# Altium schematic sheet Sheet2.SchDoc
size A4; SheetNumber: 2; SheetTotal: 6
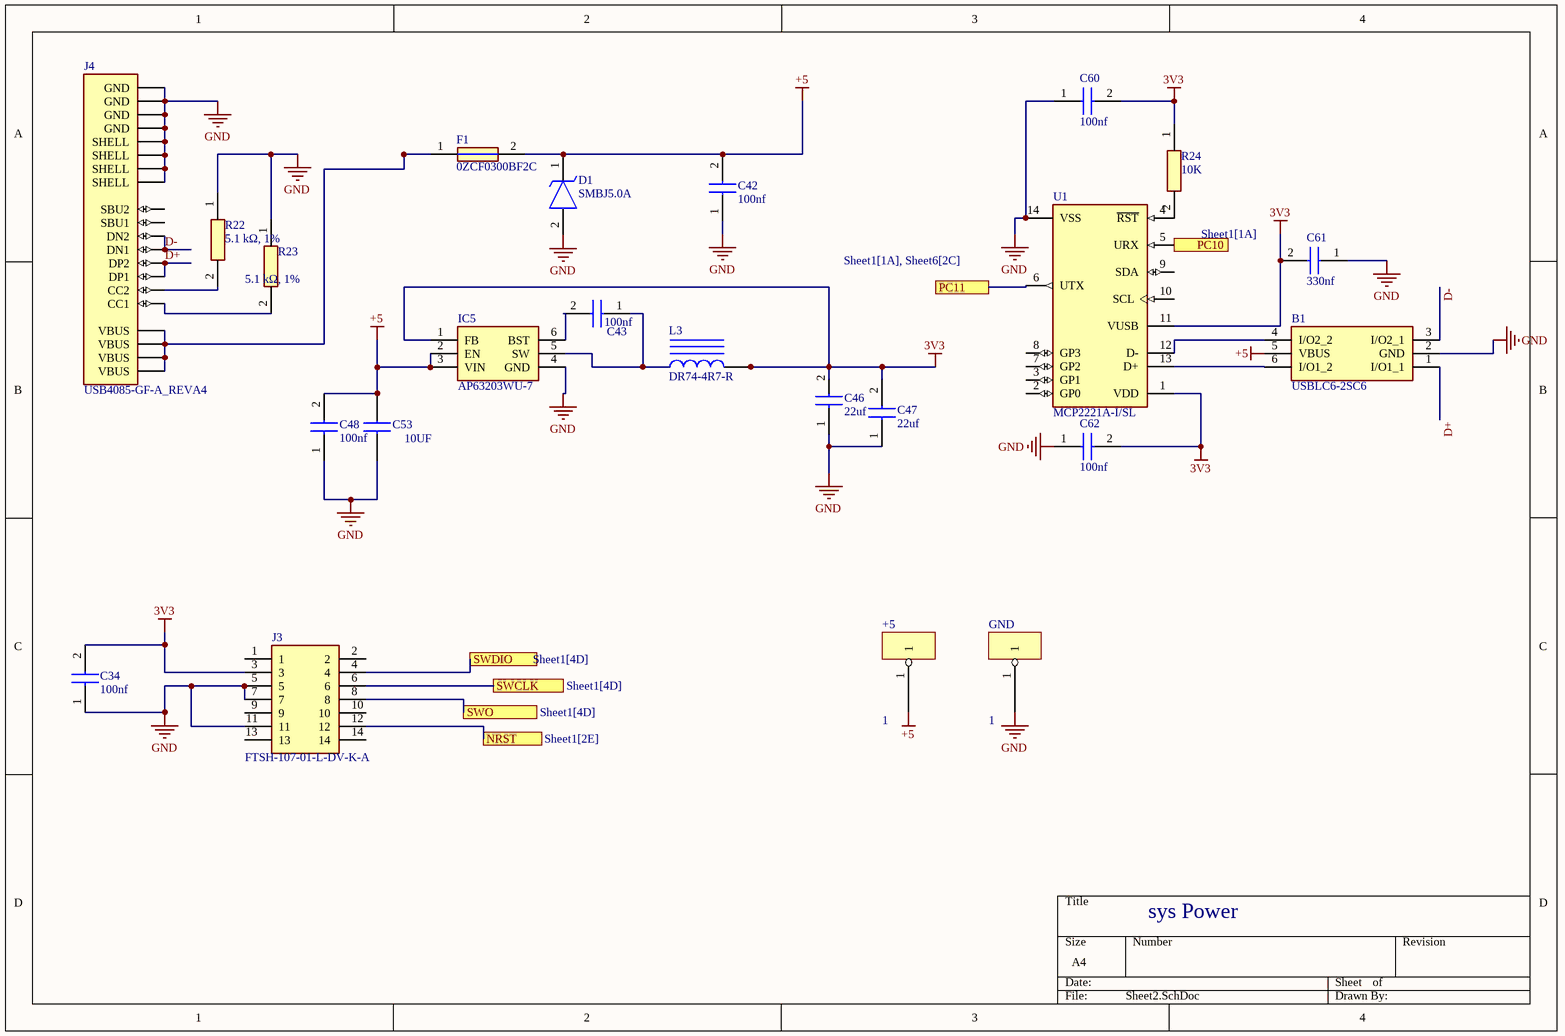
[diagram p0: Sheet2.SchDoc]

## Parts
+5  1  [ANT]
B1  USBLC6-2SC6  [SOT95P280X145-6N]
C34  100nf  [CAPC1608X95N]
C42  100nf  [CAPC1608X95N]
C43  100nf  [CAPC1608X95N]
C46  22uf  [CAPC1608X95N]
C47  22uf  [CAPC1608X95N]
C48  100nf  [CAPC1608X95N]
C53  10UF  [CAPC1608X90N]
C60  100nf  [CAPC1608X95N]
C61  330nf  [CAPC1608X95N]
C62  100nf  [CAPC1608X95N]
D1  SMBJ5.0A  [SMBJ12A]
F1  0ZCF0300BF2C  [FUSC7451X115N]
GND  1  [ANT]
IC5  AP63203WU-7  [AP63203WU7]
J3  FTSH-107-01-L-DV-K-A  [FTSH-107-XX-YYY-DV-K-A]
J4  USB4085-GF-A_REVA4  [GCT_USB4085-GF-A_REVA4]
L3  DR74-4R7-R  [COBU-DR74-4R7-R_V]
R22  5.1 kΩ, 1%  [RESC1608X55N]
R23  5.1 kΩ, 1%  [RESC1608X55N]
R24  10K  [RESC1608X55N]
U1  MCP2221A-I/SL  [FP-C04-065-SL-MFG]

## Ports
NRST (see Sheet1[2E]), PC10 (see Sheet1[1A]), PC11 (see Sheet1[1A], Sheet6[2C]), SWCLK (see Sheet1[4D]), SWDIO (see Sheet1[4D]), SWO (see Sheet1[4D])

## Nets
3V3: C34.2 C46.2 C47.2 C60.2 C61.2 C62.2 IC5.1(FB) J3.3 L3.2 R24.1 U1.1(VDD) U1.11(VUSB)
+5: +5.1 B1.5(VBUS) C42.2 C48.2 C53.2 D1.1(K) F1.2 IC5.2(EN) IC5.3(VIN)
GND: B1.2(GND) C34.1 C42.1 C46.1 C47.1 C48.1 C53.1 C60.1 C61.1 C62.1 D1.2(A) GND.1 IC5.4(GND) J3.5 J3.7 J3.11 J4.A1(GND) J4.A12(GND) J4.B1(GND) J4.B12(GND) J4.S1(SHELL) J4.S2(SHELL) J4.S3(SHELL) J4.S4(SHELL) R22.1 R23.1 U1.14(VSS)
D+: B1.1(I/O1_1) J4.A6(DP1) J4.B6(DP2)
D-: B1.3(I/O2_1) J4.A7(DN1) J4.B7(DN2)
NRST: J3.12 ; port NRST
PC10: U1.5(URX) ; port PC10
PC11: U1.6(UTX) ; port PC11
SWCLK: J3.6 ; port SWCLK
SWDIO: J3.4 ; port SWDIO
SWO: J3.8 ; port SWO
NetB1_4: B1.4(I/O2_2) U1.12(D-)
NetB1_6: B1.6(I/O1_2) U1.13(D+)
NetC43_1: C43.1 IC5.5(SW) L3.1
NetC43_2: C43.2 IC5.6(BST)
NetF1_1: F1.1 J4.A4(VBUS) J4.A9(VBUS) J4.B4(VBUS) J4.B9(VBUS)
NetJ4_A5: J4.A5(CC1) R23.2
NetJ4_B5: J4.B5(CC2) R22.2
NetR24_2: R24.2 U1.4(~{RST})

Not connected (* = marked no-connect by the designer): J3 1 2 9 10 13 14; J4 A8(SBU1) B8(SBU2); U1 2(GP0) 3(GP1) 7(GP2) 8(GP3) 9(SDA) 10(SCL)

## Notes on the sheet
- sys Power

## Library data of the parts
B1 = USBLC6-2SC6: TVS Diode Array Uni-Directional USBLC6-2SC6 17V, SOT-23 6-Pin; Manufacturer_Name: STMicroelectronics; Geometry.Height: 1.45mm; Manufacturer_Part_Number: USBLC6-2SC6; Mouser Part Number: 511-USBLC6-2SC6; Mouser Price/Stock: https://www.mouser.co.uk/ProductDetail/STMicroelectronics/USBLC6-2SC6?qs=po45yt2pPpu%2FhNIlwQdTlg%3D%3D; Arrow Part Number: USBLC6-2SC6; Arrow Price/Stock: https://www.arrow.com/en/products/usblc6-2sc6/stmicroelectronics.html?utm_currency=USD&region=nac; Datasheet Link: https://www.st.com/resource/en/datasheet/usblc6-2.pdf
C34 C42 C43 C46-C48 C60-C62 = VJ0603Y104KXACW1BC: Capacitor; Manufacturer_Name: Vishay; Datasheet Link: https://componentsearchengine.com/Datasheets/2/VJ0603Y104KXACW1BC.pdf; Height: 0.95mm; Manufacturer_Part_Number: VJ0603Y104KXACW1BC; Mouser Part Number: N/A; Mouser Price/Stock: https://www.mouser.co.uk/ProductDetail/Vishay-Vitramon/VJ0603Y104KXACW1BC?qs=M%2FcR%2FDpCXFVPJpohemA31Q%3D%3D; Arrow Part Number: VJ0603Y104KXACW1BC; Arrow Price/Stock: https://www.arrow.com/en/products/vj0603y104kxacw1bc/vishay?utm_currency=USD&region=nac
C53 = CL10A106KP8NNNC: 10F +/-10% 10V Ceramic Capacitor X5R 0603 (1608 Metric); Manufacturer_Name: SAMSUNG; Geometry.Height: 0.9mm; Manufacturer_Part_Number: CL10A106KP8NNNC; Mouser Part Number: 187-CL10A106KP8NNNC; Mouser Price/Stock: https://www.mouser.co.uk/ProductDetail/Samsung-Electro-Mechanics/CL10A106KP8NNNC?qs=X6jEic%2FHinAlyfRHj7fKwg%3D%3D; Arrow Part Number: CL10A106KP8NNNC; Arrow Price/Stock: https://www.arrow.com/en/products/cl10a106kp8nnnc/samsung-electro-mechanics?utm_currency=USD&region=europe; Datasheet Link: https://datasheet.datasheetarchive.com/originals/distributors/Datasheets-DGA10/2415998.pdf
D1 = SMBJ5.0A: TVS Diode (Uni-directional); Manufacturer_Name: STMicroelectronics; Datasheet Link: https://www.st.com/resource/en/datasheet/smbj12a.pdf; Height: 2.45mm; Manufacturer_Part_Number: SMBJ5.0A
F1 = 0ZCF0300BF2C: Fuse; Manufacturer_Name: BelFuse; Datasheet Link: https://componentsearchengine.com/Datasheets/1/0ZCF0300BF2C.pdf; Height: 1.15mm; Manufacturer_Part_Number: 0ZCF0300BF2C; Mouser Part Number: 530-0ZCF0300BF2C; Mouser Price/Stock: https://www.mouser.co.uk/ProductDetail/Bel-Fuse/0ZCF0300BF2C?qs=jyPKP7YLNfCnIt8PHbsbtw%3D%3D; Arrow Part Number: 0ZCF0300BF2C; Arrow Price/Stock: https://www.arrow.com/en/products/0zcf0300bf2c/bel-group
IC5 = AP63203WU-7: Integrated Circuit; Manufacturer_Name: Diodes Incorporated; Datasheet Link: https://www.diodes.com/assets/Datasheets/AP63200-AP63201-AP63203-AP63205.pdf; Height: 1mm; Manufacturer_Part_Number: AP63203WU-7; Mouser Part Number: 621-AP63203WU-7; Mouser Price/Stock: https://www.mouser.co.uk/ProductDetail/Diodes-Incorporated/AP63203WU-7?qs=u16ybLDytRZ1JqxbuLkMJw%3D%3D; Arrow Part Number: AP63203WU-7; Arrow Price/Stock: https://www.arrow.com/en/products/ap63203wu-7/diodes-incorporated?utm_currency=USD&region=europe
J3 = FTSH-107-01-L-DV-K-A: Connector; Manufacturer_Name: SAMTEC; Datasheet Link: http://suddendocs.samtec.com/prints/ftsh-1xx-xx-xxx-dv-xxx-xxx-mkt.pdf; Manufacturer_Part_Number: FTSH-107-01-L-DV-K-A; Mouser Part Number: 200-FTSH10701LDVKA; Mouser Price/Stock: https://www.mouser.co.uk/ProductDetail/Samtec/FTSH-107-01-L-DV-K-A?qs=PB6%2FjmICvI3xEHFou4PhNg%3D%3D; Arrow Part Number: FTSH-107-01-L-DV-K-A; Arrow Price/Stock: https://www.arrow.com/en/products/ftsh-107-01-l-dv-k-a/samtec?utm_currency=USD&region=europe
J4 = USB4085-GF-A_REVA4: USB-C (USB TYPE-C) USB 2.0 Receptacle Connector 24 (16+8 Dummy) Position Through Hole, Right Angle, low cost, 3.46mm profile, 16 pin, horizontal, Top mount; MF: Global Connector Technology; SnapEDA_Link: https://www.snapeda.com/parts/USB4085-GF-A/Global+Connector+Technology/view-part/?ref=snap; Package: None; MP: USB4085-GF-A; Check_prices: https://www.snapeda.com/parts/USB4085-GF-A/Global+Connector+Technology/view-part/?ref=eda; Purchase-URL: https://pricing.snapeda.com/search/part/USB4085-GF-A/?ref=eda; Price: None; Value: *; Availability: In Stock
L3 = CMP-2000-06180-1: High Power Density, High Efficiency, Shielded Inductor, 4.7 uH, -40 to 125 degC, RoHS, Tape and Reel; Manufacturer: Eaton; Tolerance: ±20%; Current - Saturation: 4.37A; Type: Wirewound; Frequency - Test: 100kHz; Current Rating: 3.34A; DC Resistance (DCR): 25.4mOhm; Inductance: 4.7µH; Material - Core: Ferrite; Package Reference: DR74-4R7-R; Ratings: -; Frequency - Self Resonant: -; Operating Temperature: -40°C~125°C; Family: FixedInductors; Package / Case: Nonstandard; Mounting Type: SurfaceMount; Series: DR; Q @ Freq: -; Datasheet Version: 12/2012; Package Description: 2-Pin Surface Mount Device, Body 7.6 x 7.6 mm; Height - Seated (Max): 0.171"(4.35mm); Datasheet URL: https://datasheet.ciiva.com/14667/0900766b8116a153-14667792.pdf; Packaging: Tape&amp;Reel(TR); Manufacturer URL: http://www.cooperindustries.com/content/public/en/bussmann/electronics.html; Mounting Technology: SurfaceMount; Size / Dimension: 0.299"Lx0.299"W(7.60mmx7.60mm); Category: Inductors,Coils,Chokes; Shielding: Shielded
R22-R24 = RC0603FR-071KL: Resistor; Manufacturer_Name: YAGEO; Datasheet Link: https://www.yageo.com/upload/media/product/productsearch/datasheet/rchip/PYu-RC_Group_51_RoHS_L_12.pdf; Height: 0.55mm; Manufacturer_Part_Number: RC0603FR-071KL; Mouser Part Number: 603-RC0603FR-071KL; Mouser Price/Stock: https://www.mouser.co.uk/ProductDetail/YAGEO/RC0603FR-071KL?qs=VU8sRB4EgwApHsk4rF%2F3zg%3D%3D; Arrow Part Number: RC0603FR-071KL; Arrow Price/Stock: https://www.arrow.com/en/products/rc0603fr-071kl/yageo?utm_currency=USD&region=nac
U1 = CMP-06284-000011-1: IC USB TO I2C/UART 14SOIC; Manufacturer: Microchip; Min Supply Voltage: 3V; Usb Standard: USB 2.0; Max Supply Voltage: 5.5V; Nominal Supply Current: 10-13mA; Automotive Grade: Grade 3; Interface: I2C,UART,USB; Standoff Height: 0.1mm; Max Junction Temp: +150°C; Data Rate: 12Mbits/s; Lead Free: Yes; Height: 1.75mm; Octopart: https://octopart.com/mcp2221a-i%2Fsl-microchip-71704986; Package: C04-065-SL; Digikey Description: IC USB TO I2C/UART 14SOIC; Temperature Range Low: -40°C; Temperature: -40°C to +85°C; Category: IC; Temperature Range High: +85°C; Ambient Temperature Range Low: -40°C; Device Class L1: Integrated Circuits (ICs); Footprint Url: http://ww1.microchip.com/downloads/en/DeviceDoc/14L%20SOIC%203_90%20mm%20%28SL%29%20C04-00065d.pdf; Automotive: Yes; ComponentLink2URL: http://ww1.microchip.com/downloads/en/DeviceDoc/20005565B.pdf; Ambient Temperature Range High: +85°C; RoHS: TRUE; Device Class L3: USB Interface ICs; ComponentLink2Description: Datasheet; Device Class L2: Interface ICs; Manufacturer Part Number: MCP2221A-I/SL; Ipc Land Pattern Name: SOIC127P600X175-14